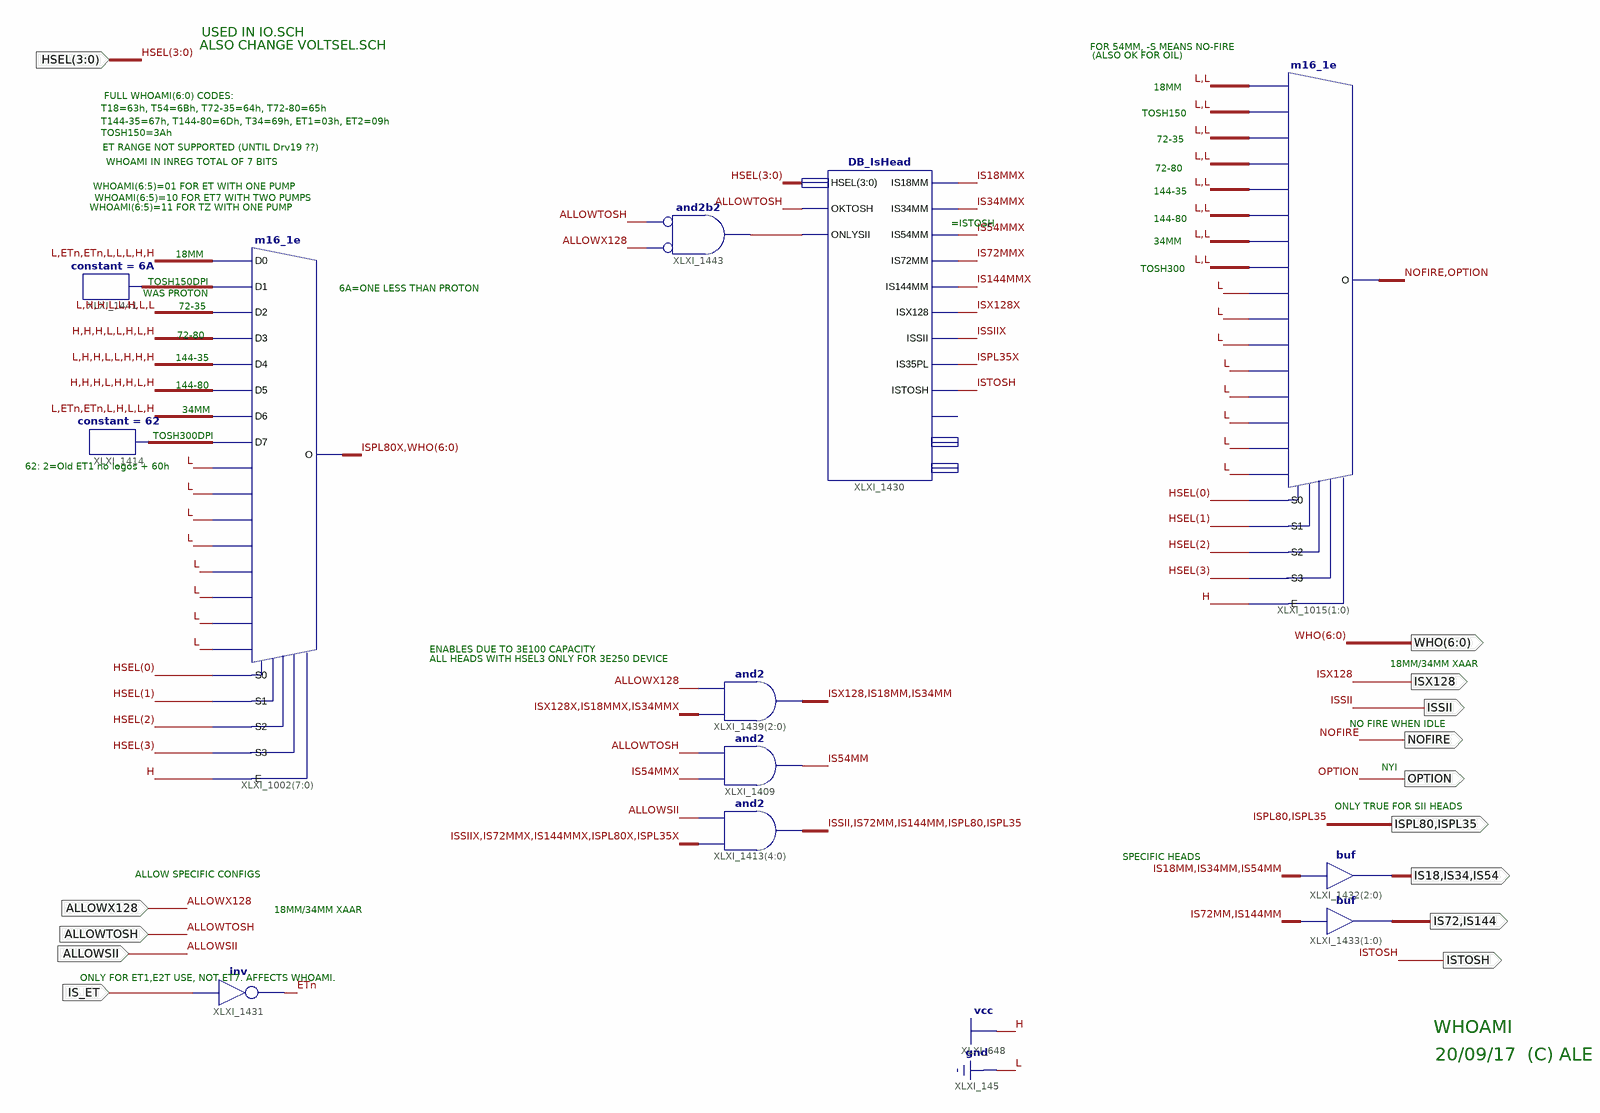
[diagram p0: schematic sheet 1]
// Xilinx ISE schematic DB_WhoAmI.sch (spartan3e) as structural Verilog: 12 symbols, 14 ports
module DB_WhoAmI (
  input  [3:0] HSEL,
  input  ALLOWSII,
  input  ALLOWX128,
  input  IS_ET,
  input  ALLOWTOSH,
  output ISTOSH,
  output [6:0] WHO,
  output ISX128,
  output ISSII,
  output IS72,
  output IS144,
  output IS18,
  output IS34,
  output IS54,
  output NOFIRE,
  output ISPL80,
  output ISPL35,
  output OPTION
);

  wire ETn, IS18MM, IS18MMX, IS34MM, IS34MMX, IS54MM, IS54MMX, IS72MM, IS72MMX, IS144MM, IS144MMX, ISPL35X,
       ISPL80X, ISSIIX, ISX128X, XLXN_17;
  wire [7:0] XLXN_5, XLXN_6;

  m16_1e XLXI_1015[1:0] (
    .D0(2'b00), .D1(2'b00), .D10(1'b0), .D11(1'b0), .D12(1'b0), .D13(1'b0), .D14(1'b0), .D15(1'b0),
    .D2(2'b00), .D3(2'b00), .D4(2'b00), .D5(2'b00), .D6(2'b00), .D7(2'b00), .D8(1'b0), .D9(1'b0), .E(1'b1),
    .S0(HSEL[0]), .S1(HSEL[1]), .S2(HSEL[2]), .S3(HSEL[3]), .O({NOFIRE, OPTION}));
  m16_1e XLXI_1002[7:0] (
    .D0({1'b0, {2{ETn}}, 5'b00011}), .D1(XLXN_6), .D10(1'b0), .D11(1'b0), .D12(1'b0), .D13(1'b0), .D14(1'b0),
    .D15(1'b0), .D2(8'b01100100), .D3(8'b11100101), .D4(8'b01100111), .D5(8'b11101101),
    .D6({1'b0, {2{ETn}}, 5'b01001}), .D7(XLXN_5), .D8(1'b0), .D9(1'b0), .E(1'b1), .S0(HSEL[0]), .S1(HSEL[1]),
    .S2(HSEL[2]), .S3(HSEL[3]), .O({ISPL80X, WHO}));
  constant #(.CValue("62")) XLXI_1414 (.O(XLXN_5));
  and XLXI_1409 (IS54MM, IS54MMX, ALLOWTOSH);
  assign {ISSII, IS72MM, IS144MM, ISPL80, ISPL35} = {ISSIIX, IS72MMX, IS144MMX, ISPL80X, ISPL35X} & {5{ALLOWSII}};  // and2 XLXI_1413[4..0], 5 bits wide
  assign {ISX128, IS18MM, IS34MM} = {ISX128X, IS18MMX, IS34MMX} & {3{ALLOWX128}};  // and2 XLXI_1439[2..0], 3 bits wide
  assign {IS18, IS34, IS54} = {IS18MM, IS34MM, IS54MM};  // buf XLXI_1432[2..0], 3 bits wide
  assign {IS72, IS144} = {IS72MM, IS144MM};  // buf XLXI_1433[1..0], 2 bits wide
  DB_IsHead XLXI_1430 (
    .HSEL(HSEL), .IS144MM(IS144MMX), .IS18MM(IS18MMX), .IS34MM(IS34MMX), .IS35PL(ISPL35X), .IS54MM(IS54MMX),
    .IS72MM(IS72MMX), .ISSII(ISSIIX), .ISTOSH(ISTOSH), .ISX128(ISX128X), .OKTOSH(ALLOWTOSH), .ONLYSII(XLXN_17));  // open: HIRES, ISSIZE, ISTYPE
  constant #(.CValue("6A")) XLXI_1441 (.O(XLXN_6));
  not XLXI_1431 (ETn, IS_ET);
  and XLXI_1443 (XLXN_17, ~ALLOWX128, ~ALLOWTOSH);  // and2b2

  // Notes on the sheet:
  //   USED IN IO.SCH
  //   ALSO CHANGE VOLTSEL.SCH
  //   FOR 54MM, -S MEANS NO-FIRE
  //   (ALSO OK FOR OIL)
  //   18MM
  //   FULL WHOAMI(6:0) CODES:
  //   T18=63h, T54=6Bh, T72-35=64h, T72-80=65h
  //   TOSH150
  //   T144-35=67h, T144-80=6Dh, T34=69h, ET1=03h, ET2=09h
  //   TOSH150=3Ah
  //   72-35
  //   ET RANGE NOT SUPPORTED (UNTIL Drv19 ??)
  //   WHOAMI IN INREG TOTAL OF 7 BITS
  //   72-80
  //   WHOAMI(6:5)=01 FOR ET WITH ONE PUMP
  //   144-35
  //   WHOAMI(6:5)=10 FOR ET7 WITH TWO PUMPS
  //   WHOAMI(6:5)=11 FOR TZ WITH ONE PUMP
  //   144-80
  //   =ISTOSH
  //   34MM
  //   18MM
  //   TOSH300
  //   TOSH150DPI
  //   6A=ONE LESS THAN PROTON
  //   WAS PROTON
  //   72-35
  //   72-80
  //   144-35
  //   144-80
  //   34MM
  //   TOSH300DPI
  //   62: 2=Old ET1 no logos + 60h
  //   ENABLES DUE TO 3E100 CAPACITY
  //   ALL HEADS WITH HSEL3 ONLY FOR 3E250 DEVICE
  //   18MM/34MM XAAR
  //   NO FIRE WHEN IDLE
  //   NYI
  //   ONLY TRUE FOR SII HEADS
  //   SPECIFIC HEADS
  //   ALLOW SPECIFIC CONFIGS
  //   18MM/34MM XAAR
  //   ONLY FOR ET1,E2T USE, NOT ET7. AFFECTS WHOAMI.
  //   WHOAMI
  //   20/09/17  (C) ALE
endmodule
